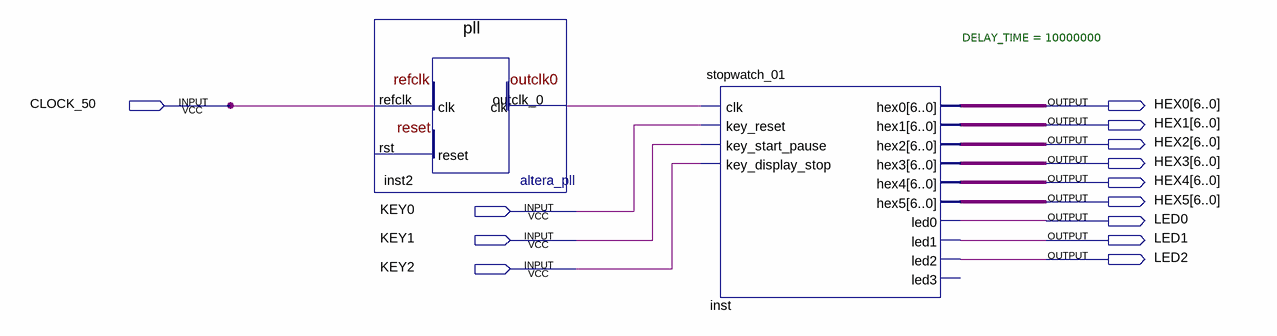
[diagram p0: schematic sheet]
// Quartus schematic Stopwatch.bdf as structural Verilog: 2 symbols, 13 pins
module Stopwatch (
  input  CLOCK_50,
  input  KEY0,
  input  KEY1,
  input  KEY2,
  output [6:0] HEX0,
  output [6:0] HEX1,
  output [6:0] HEX2,
  output [6:0] HEX3,
  output [6:0] HEX4,
  output [6:0] HEX5,
  output LED0,
  output LED1,
  output LED2
);

  wire inst2_outclk_0;

  pll inst2 (.refclk(CLOCK_50), .outclk_0(inst2_outclk_0));  // open: rst
  stopwatch_01 #(.DELAY_TIME(10000000)) inst (
    .clk(inst2_outclk_0), .key_reset(KEY0), .key_start_pause(KEY1), .key_display_stop(KEY2), .hex0(HEX0),
    .hex1(HEX1), .hex2(HEX2), .hex3(HEX3), .hex4(HEX4), .hex5(HEX5), .led0(LED0), .led1(LED1), .led2(LED2));  // open: led3
endmodule
